# EAGLE design warps_v30 (EAGLE 9.6.2)

## Sheet 1 of 3
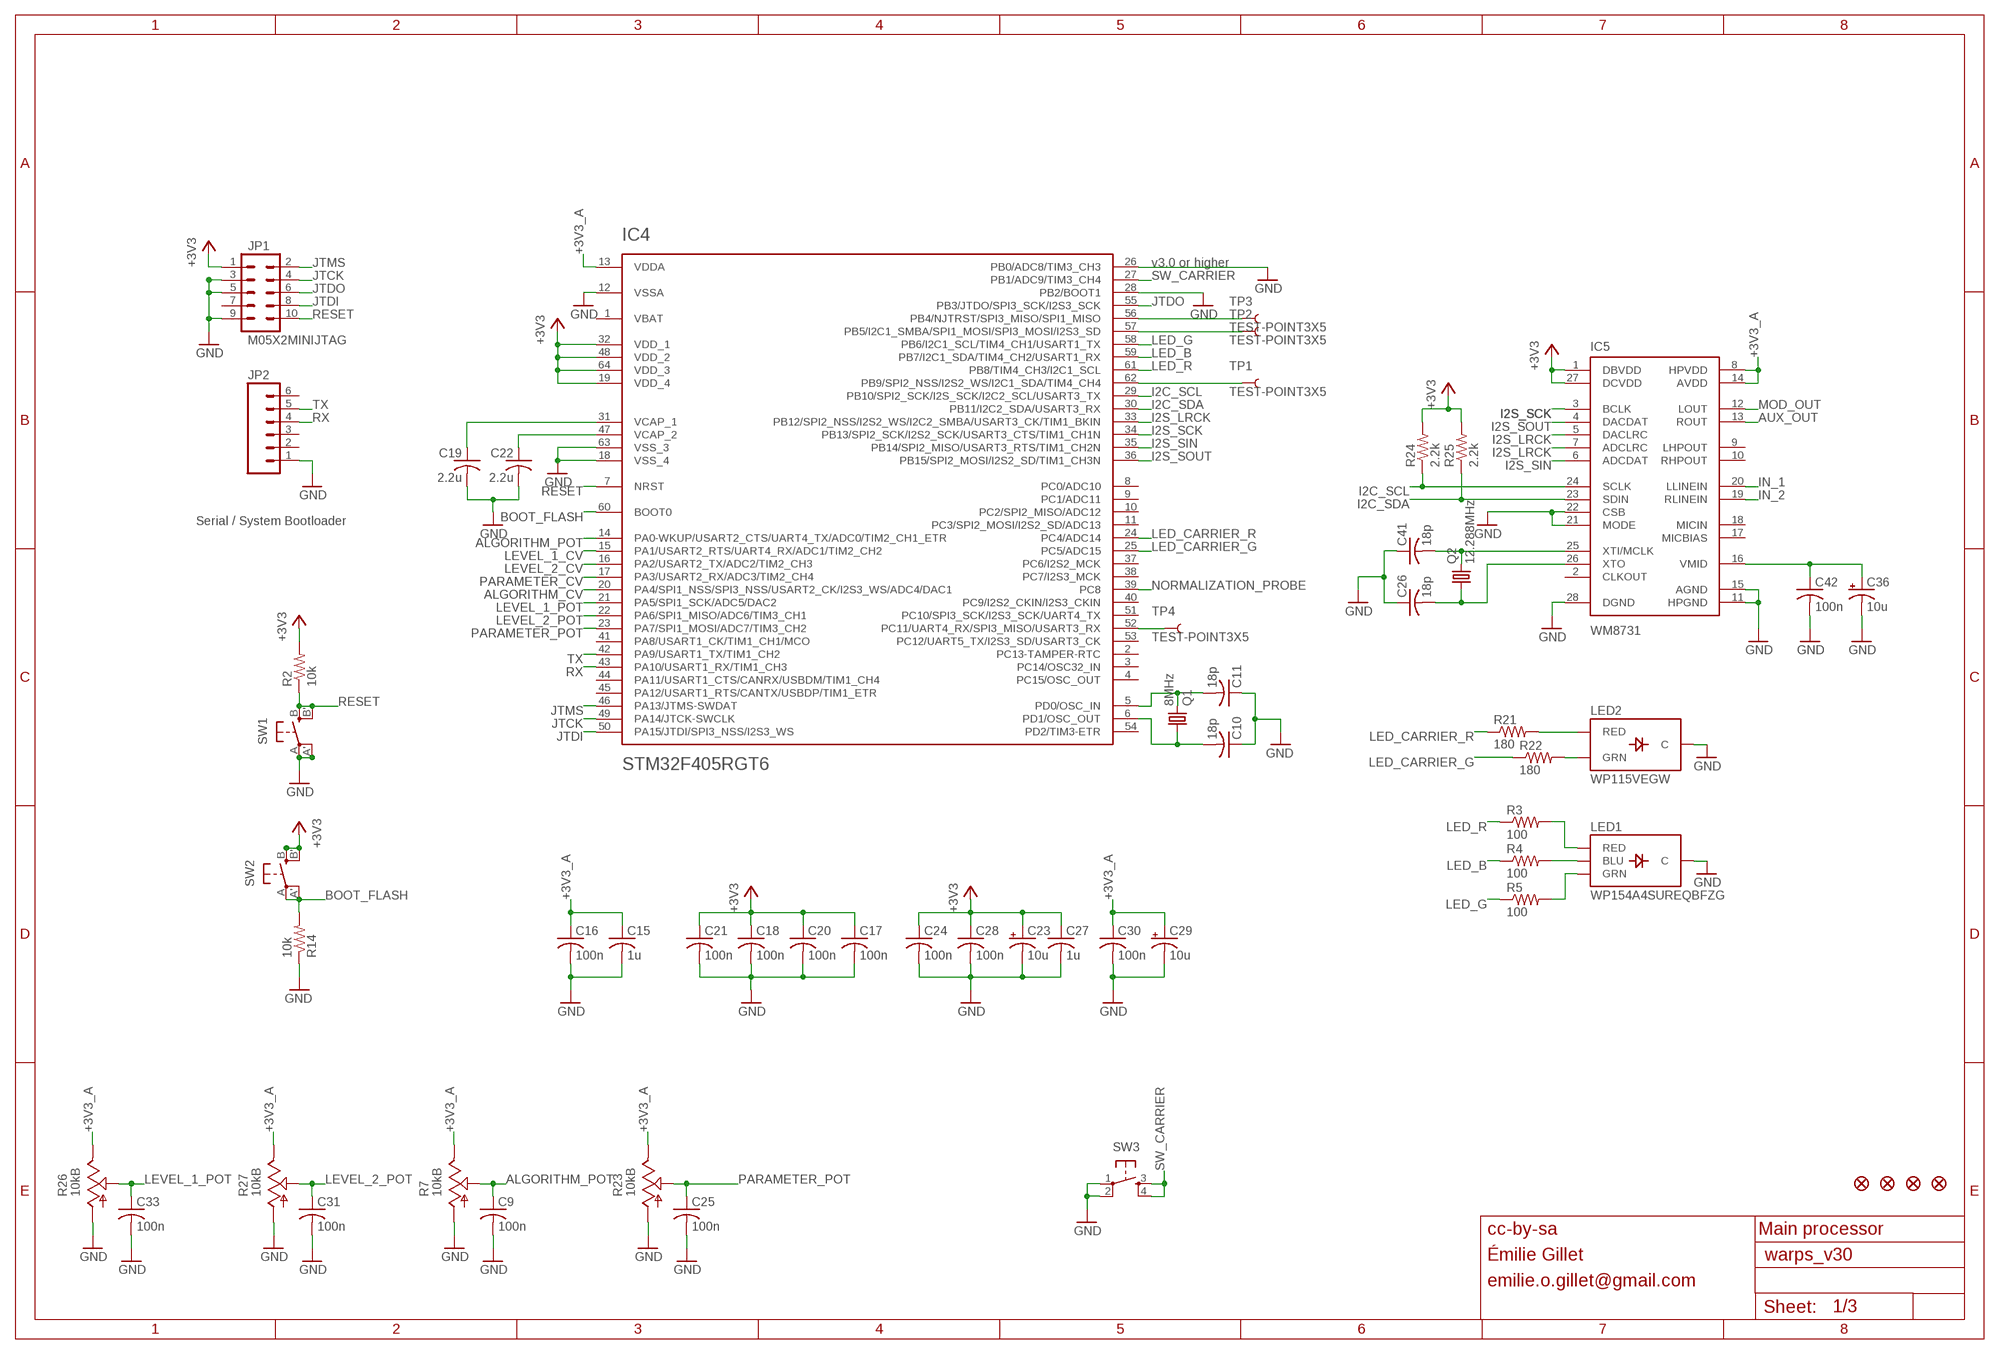
[diagram p0: schematic, sheet 1]

### Parts
C9  100n  C-USC0603  [C0603]
C10  18p  C-USC0603  [C0603]
C11  18p  C-USC0603  [C0603]
C15  1u  C-USC0603  [C0603]
C16  100n  C-USC0603  [C0603]
C17  100n  C-USC0603  [C0603]
C18  100n  C-USC0603  [C0603]
C19  2.2u  C-USC0805  [C0805]
C20  100n  C-USC0603  [C0603]
C21  100n  C-USC0603  [C0603]
C22  2.2u  C-USC0805  [C0805]
C23  10u  CPOL-USA  [PANASONIC_A]
C24  100n  C-USC0603  [C0603]
C25  100n  C-USC0603  [C0603]
C26  18p  C-USC0603  [C0603]
C27  1u  C-USC0603  [C0603]
C28  100n  C-USC0603  [C0603]
C29  10u  CPOL-USA  [PANASONIC_A]
C30  100n  C-USC0603  [C0603]
C31  100n  C-USC0603  [C0603]
C33  100n  C-USC0603  [C0603]
C36  10u  CPOL-USA  [PANASONIC_A]
C41  18p  C-USC0603  [C0603]
C42  100n  C-USC0603  [C0603]
F1  FIDUCIAL1X2  [FIDUCIAL-1X2]
F2  FIDUCIAL1X2  [FIDUCIAL-1X2]
F3  FIDUCIAL1X2  [FIDUCIAL-1X2]
F4  FIDUCIAL1X2  [FIDUCIAL-1X2]
IC4  STM32F405RGT6  STM32F20X  [TQFP-10X10-64]
IC5  WM8731  [SSOP28]
JP1  M05X2MINIJTAG  [2X5-1.27]
JP2  M06SIP  [1X06]
LED1  WP154A4SUREQBFZG  LED-TRICOLOR-THROUGHHOLE  [LED-TRICOLOR-THROUGHHOLE]
LED2  WP115VEGW  LED-BICOLOR-THROUGHHOLE  [LED-BICOLOR-THROUGHHOLE]
Q1  8MHz  CRYSTALHC49UP  [HC49UP]
Q2  12.288MHz  CRYSTALHC49UP  [HC49UP]
R2  10k  R-US_R0603  [R0603]
R3  100  R-US_R0603  [R0603]
R4  100  R-US_R0603  [R0603]
R5  100  R-US_R0603  [R0603]
R7  10kB  POT_USVERTICAL_PS  [ALPS_POT_VERTICAL_PS]
R14  10k  R-US_R0603  [R0603]
R21  180  R-US_R0603  [R0603]
R22  180  R-US_R0603  [R0603]
R23  10kB  POT_USVERTICAL_PS  [ALPS_POT_VERTICAL_PS]
R24  2.2k  R-US_R0603  [R0603]
R25  2.2k  R-US_R0603  [R0603]
R26  10kB  POT_USVERTICAL  [ALPS_POT_VERTICAL]
R27  10kB  POT_USVERTICAL  [ALPS_POT_VERTICAL]
SW1  EVQQ2  [EVQ-Q2]
SW2  EVQQ2  [EVQ-Q2]
SW3  TAC_SWITCHPTH  [TACTILE-PTH]
TP1  TEST-POINT3X5  [PAD.03X.05]
TP2  TEST-POINT3X5  [PAD.03X.05]
TP3  TEST-POINT3X5  [PAD.03X.05]
TP4  TEST-POINT3X5  [PAD.03X.05]

### Nets
+3V3: C17.1 C18.1 C20.1 C21.1 C23.+ C24.1 C27.1 C28.1 IC4.19(VDD_4) IC4.32(VDD_1) IC4.48(VDD_2) IC4.64(VDD_3) IC5.1(DBVDD) IC5.27(DCVDD) JP1.1 R2.2 R24.2 R25.2 SW2.B'(S1) SW2.B(S) ; also sheet 2,3
+3V3_A: C15.1 C16.1 C29.+ C30.1 IC4.13(VDDA) IC5.8(HPVDD) IC5.14(AVDD) R7.P$1(E) R23.P$1(E) R26.P$1(E) R27.P$1(E) ; also sheet 2,3
ALGORITHM_CV: IC4.20(PA4/SPI1_NSS/SPI3_NSS/USART2_CK/I2S3_WS/ADC4/DAC1) ; also sheet 2
ALGORITHM_POT: C9.1 IC4.14(PA0-WKUP/USART2_CTS/UART4_TX/ADC0/TIM2_CH1_ETR) R7.P$2(S)
AUX_OUT: IC5.13(ROUT) ; also sheet 2
BOOT_FLASH: IC4.60(BOOT0) R14.2 SW2.A'(P1) SW2.A(P)
GND: C9.2 C10.1 C11.1 C15.2 C16.2 C17.2 C18.2 C19.2 C20.2 C21.2 C22.2 C23.- C24.2 C25.2 C26.1 C27.2 C28.2 C29.- C30.2 C31.2 C33.2 C36.- C41.1 C42.2 IC4.12(VSSA) IC4.18(VSS_4) IC4.26(PB0/ADC8/TIM3_CH3) IC4.28(PB2/BOOT1) IC4.63(VSS_3) IC5.11(HPGND) IC5.15(AGND) IC5.21(MODE) IC5.22(CSB) IC5.28(DGND) JP1.3 JP1.5 JP1.9 JP2.1 LED1.GND(C) LED2.2(C) R7.P$3(A) R14.1 R23.P$3(A) R26.P$3(A) R27.P$3(A) SW1.A'(P1) SW1.A(P) SW3.1 SW3.2 ; also sheet 2,3
I2C_SCL: IC4.29(PB10/SPI2_SCK/I2S_SCK/I2C2_SCL/USART3_TX) IC5.24(SCLK) R24.1
I2C_SDA: IC4.30(PB11/I2C2_SDA/USART3_RX) IC5.23(SDIN) R25.1
I2S_LRCK: IC4.33(PB12/SPI2_NSS/I2S2_WS/I2C2_SMBA/USART3_CK/TIM1_BKIN) IC5.5(DACLRC) IC5.7(ADCLRC)
I2S_SCK: IC4.34(PB13/SPI2_SCK/I2S2_SCK/USART3_CTS/TIM1_CH1N) IC5.3(BCLK)
I2S_SIN: IC4.35(PB14/SPI2_MISO/USART3_RTS/TIM1_CH2N) IC5.6(ADCDAT)
I2S_SOUT: IC4.36(PB15/SPI2_MOSI/I2S2_SD/TIM1_CH3N) IC5.4(DACDAT)
IN_1: IC5.20(LLINEIN) ; also sheet 2
IN_2: IC5.19(RLINEIN) ; also sheet 2
JTCK: IC4.49(PA14/JTCK-SWCLK) JP1.4
JTDI: IC4.50(PA15/JTDI/SPI3_NSS/I2S3_WS) JP1.8
JTDO: IC4.55(PB3/JTDO/SPI3_SCK/I2S3_SCK) JP1.6
JTMS: IC4.46(PA13/JTMS-SWDAT) JP1.2
LED_B: IC4.59(PB7/I2C1_SDA/TIM4_CH2/USART1_RX) R4.1
LED_CARRIER_G: IC4.25(PC5/ADC15) R22.1
LED_CARRIER_R: IC4.24(PC4/ADC14) R21.1
LED_G: IC4.58(PB6/I2C1_SCL/TIM4_CH1/USART1_TX) R5.1
LED_R: IC4.61(PB8/TIM4_CH3/I2C1_SCL) R3.1
LEVEL_1_CV: IC4.15(PA1/USART2_RTS/UART4_RX/ADC1/TIM2_CH2) ; also sheet 2
LEVEL_1_POT: C33.1 IC4.21(PA5/SPI1_SCK/ADC5/DAC2) R26.P$2(S)
LEVEL_2_CV: IC4.16(PA2/USART2_TX/ADC2/TIM2_CH3) ; also sheet 2
LEVEL_2_POT: C31.1 IC4.22(PA6/SPI1_MISO/ADC6/TIM3_CH1) R27.P$2(S)
MOD_OUT: IC5.12(LOUT) ; also sheet 2
N$3: LED2.3(RED) R21.2
N$7: C11.2 IC4.5(PD0/OSC_IN) Q1.2
N$8: C10.2 IC4.6(PD1/OSC_OUT) Q1.1
N$13: C22.1 IC4.47(VCAP_2)
N$14: LED2.1(GRN) R22.2
N$17: C36.+ C42.1 IC5.16(VMID)
N$19: C19.1 IC4.31(VCAP_1)
N$24: IC4.56(PB4/NJTRST/SPI3_MISO/SPI1_MISO) TP3.P$1
N$26: IC4.57(PB5/I2C1_SMBA/SPI1_MOSI/SPI3_MOSI/I2S3_SD) TP2.P$1
N$27: IC4.52(PC11/UART4_RX/SPI3_MISO/USART3_RX) TP4.P$1
N$30: IC4.62(PB9/SPI2_NSS/I2S2_WS/I2C1_SDA/TIM4_CH4) TP1.P$1
N$35: LED1.RED R3.2
N$36: LED1.BLU R4.2
N$37: LED1.GRN R5.2
N$40: C41.2 IC5.25(XTI/MCLK) Q2.2
N$41: C26.2 IC5.26(XTO) Q2.1
NORMALIZATION_PROBE: IC4.39(PC8) ; also sheet 2
PARAMETER_CV: IC4.17(PA3/USART2_RX/ADC3/TIM2_CH4) ; also sheet 2
PARAMETER_POT: C25.1 IC4.23(PA7/SPI1_MOSI/ADC7/TIM3_CH2) R23.P$2(S)
RESET: IC4.7(NRST) JP1.10 R2.1 SW1.B'(S1) SW1.B(S)
RX: IC4.43(PA10/USART1_RX/TIM1_CH3) JP2.4
SW_CARRIER: IC4.27(PB1/ADC9/TIM3_CH4) SW3.3 SW3.4
TX: IC4.42(PA9/USART1_TX/TIM1_CH2) JP2.5
Unconnected: IC4.2(PC13-TAMPER-RTC) IC4.3(PC14/OSC32_IN) IC4.4(PC15/OSC_OUT) IC4.8(PC0/ADC10) IC4.9(PC1/ADC11) IC4.10(PC2/SPI2_MISO/ADC12) IC4.11(PC3/SPI2_MOSI/I2S2_SD/ADC13) IC4.37(PC6/I2S2_MCK) IC4.38(PC7/I2S3_MCK) IC4.40(PC9/I2S2_CKIN/I2S3_CKIN) IC4.41(PA8/USART1_CK/TIM1_CH1/MCO) IC4.44(PA11/USART1_CTS/CANRX/USBDM/TIM1_CH4) IC4.45(PA12/USART1_RTS/CANTX/USBDP/TIM1_ETR) IC4.51(PC10/SPI3_SCK/I2S3_SCK/UART4_TX) IC4.53(PC12/UART5_TX/I2S3_SD/USART3_CK) IC4.54(PD2/TIM3-ETR) IC5.2(CLKOUT) IC5.9(LHPOUT) IC5.10(RHPOUT) IC5.17(MICBIAS) IC5.18(MICIN) JP1.7 JP2.2 JP2.3 JP2.6

### Notes on the sheet
- v3.0 or higher
- Serial / System Bootloader
- cc-by-sa | Main processor
- Émilie Gillet
- emilie.o.gillet@gmail.com

## Sheet 2 of 3
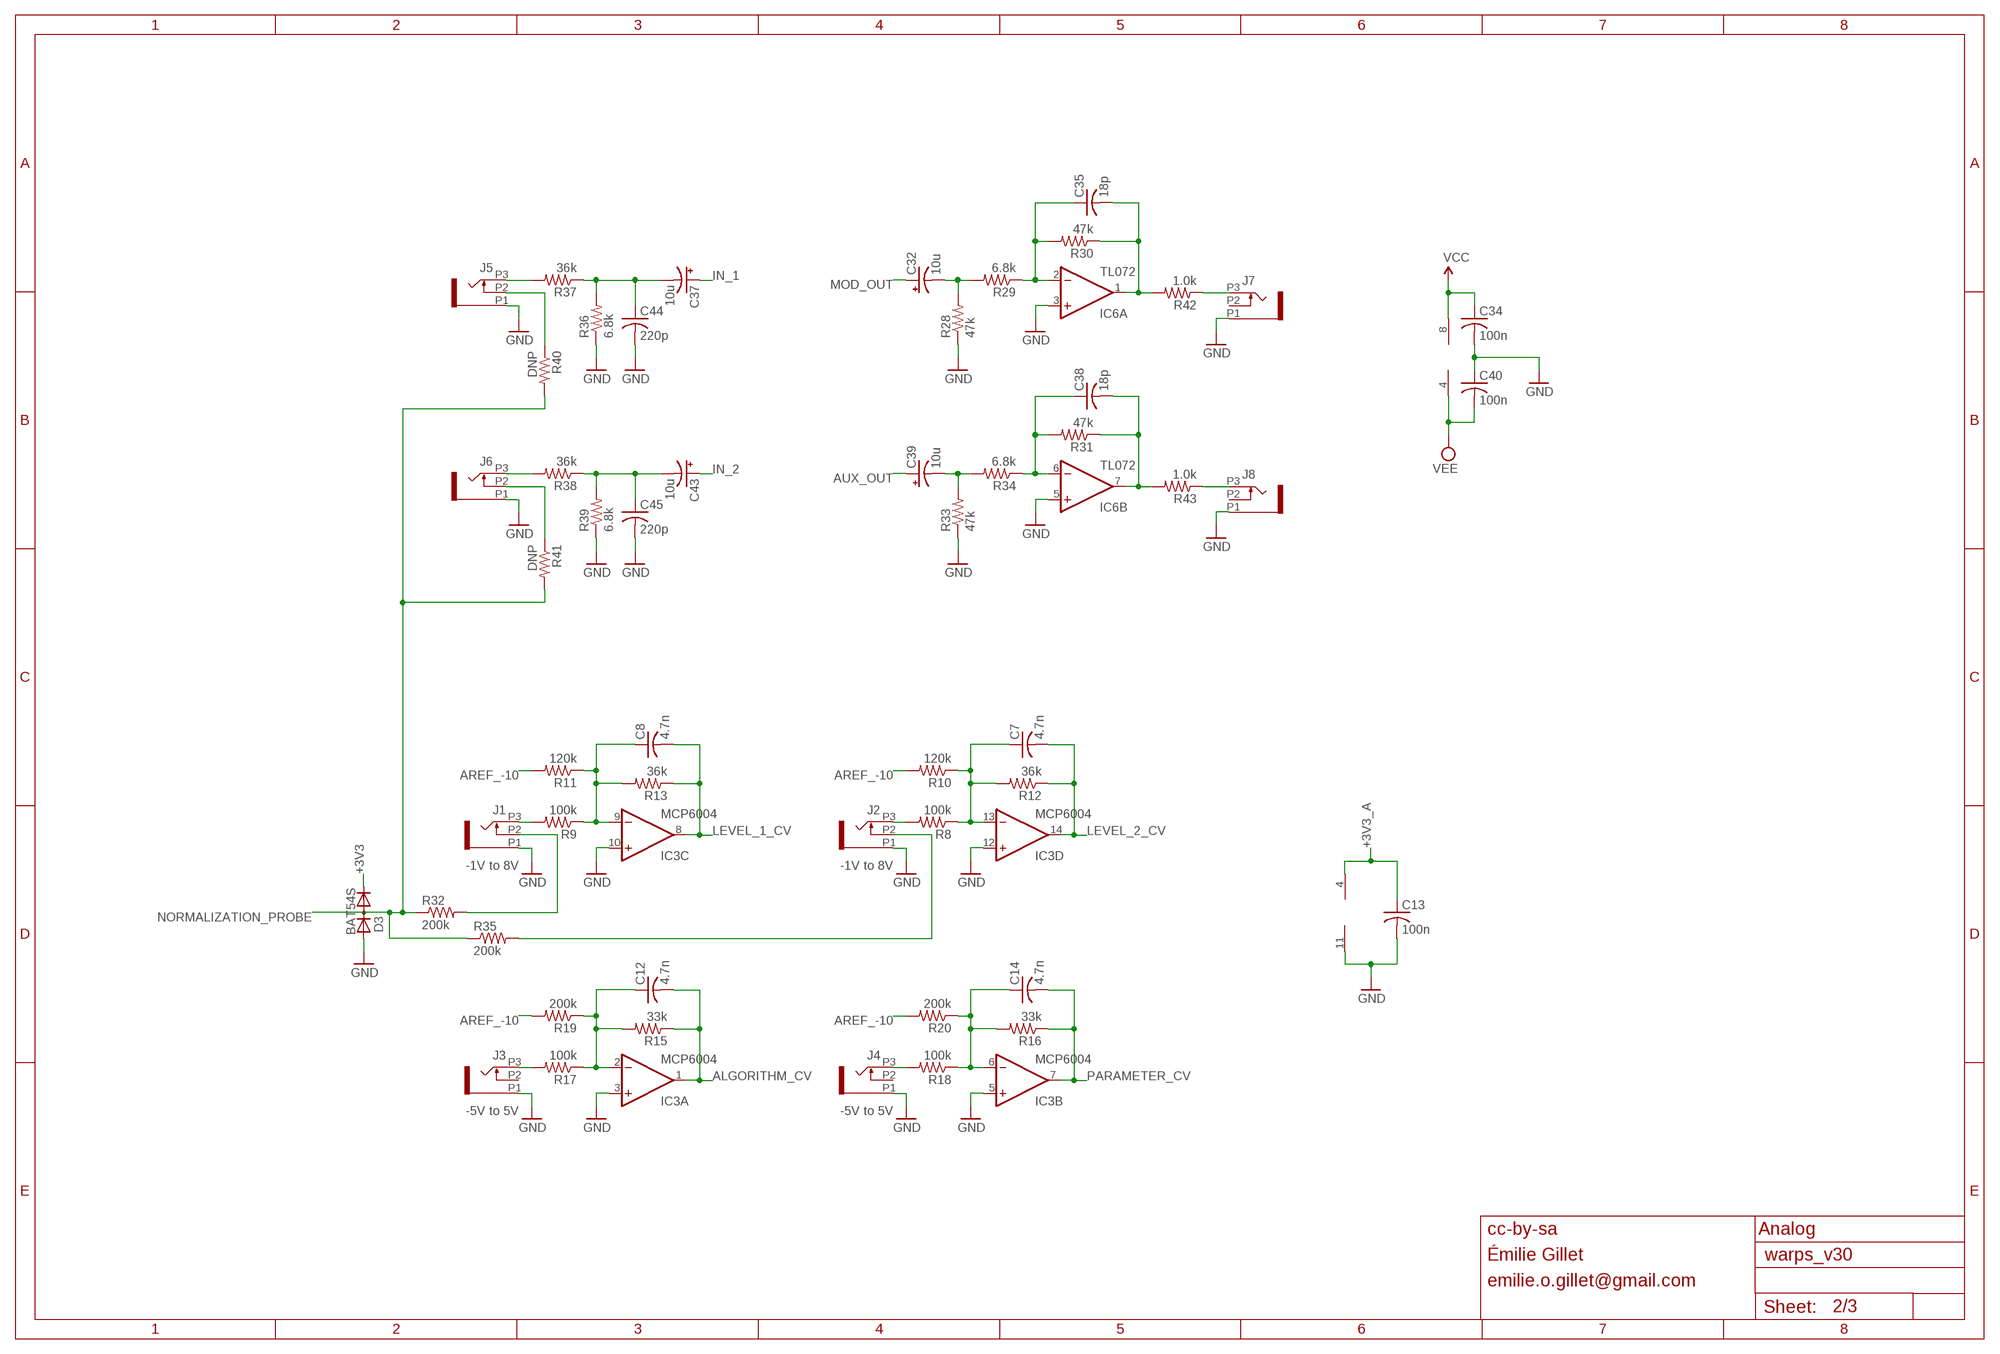
[diagram p1: schematic, sheet 2]

### Parts
C7  4.7n  C-USC0603  [C0603]
C8  4.7n  C-USC0603  [C0603]
C12  4.7n  C-USC0603  [C0603]
C13  100n  C-USC0603  [C0603]
C14  4.7n  C-USC0603  [C0603]
C32  10u  CPOL-USA  [PANASONIC_A]
C34  100n  C-USC0603  [C0603]
C35  18p  C-USC0603  [C0603]
C37  10u  CPOL-USA  [PANASONIC_A]
C38  18p  C-USC0603  [C0603]
C39  10u  CPOL-USA  [PANASONIC_A]
C40  100n  C-USC0603  [C0603]
C43  10u  CPOL-USA  [PANASONIC_A]
C44  220p  C-USC0603  [C0603]
C45  220p  C-USC0603  [C0603]
D3  BAT54S  DIODE_2CACA-SOT23  [SOT23]
IC3  MCP6004  TL074D  [SO14]
IC6  TL072  TL072D  [SO08]
J1  PJ301_THONKICONN6  [WQP_PJ_301M6]
J2  PJ301_THONKICONN6  [WQP_PJ_301M6]
J3  PJ301_THONKICONN6  [WQP_PJ_301M6]
J4  PJ301_THONKICONN6  [WQP_PJ_301M6]
J5  PJ301_THONKICONN6  [WQP_PJ_301M6]
J6  PJ301_THONKICONN6  [WQP_PJ_301M6]
J7  PJ301_THONKICONN6  [WQP_PJ_301M6]
J8  PJ301_THONKICONN6  [WQP_PJ_301M6]
R8  100k  R-US_R0603  [R0603]
R9  100k  R-US_R0603  [R0603]
R10  120k  R-US_R0603  [R0603]
R11  120k  R-US_R0603  [R0603]
R12  36k  R-US_R0603  [R0603]
R13  36k  R-US_R0603  [R0603]
R15  33k  R-US_R0603  [R0603]
R16  33k  R-US_R0603  [R0603]
R17  100k  R-US_R0603  [R0603]
R18  100k  R-US_R0603  [R0603]
R19  200k  R-US_R0603  [R0603]
R20  200k  R-US_R0603  [R0603]
R28  47k  R-US_R0603  [R0603]
R29  6.8k  R-US_R0603  [R0603]
R30  47k  R-US_R0603  [R0603]
R31  47k  R-US_R0603  [R0603]
R32  200k  R-US_R0603  [R0603]
R33  47k  R-US_R0603  [R0603]
R34  6.8k  R-US_R0603  [R0603]
R35  200k  R-US_R0603  [R0603]
R36  6.8k  R-US_R0603  [R0603]
R37  36k  R-US_R0603  [R0603]
R38  36k  R-US_R0603  [R0603]
R39  6.8k  R-US_R0603  [R0603]
R40  DNP  R-US_R0603  [R0603]
R41  DNP  R-US_R0603  [R0603]
R42  1.0k  R-US_R0603  [R0603]
R43  1.0k  R-US_R0603  [R0603]

### Nets
+3V3: D3.2(C) ; also sheet 1,3
+3V3_A: C13.1 IC3.4(P:V+) ; also sheet 1,3
ALGORITHM_CV: C12.2 IC3.1(A:OUT) R15.1 ; also sheet 1
AREF_-10: R10.2 R11.2 R19.2 R20.2 ; also sheet 3
AUX_OUT: C39.+ ; also sheet 1
GND: C13.2 C34.2 C40.1 C44.2 C45.2 D3.1(A) IC3.3(A:+IN) IC3.5(B:+IN) IC3.10(C:+IN) IC3.11(P:V-) IC3.12(D:+IN) IC6.3(A:+IN) IC6.5(B:+IN) J1.P1 J2.P1 J3.P1 J4.P1 J5.P1 J6.P1 J7.P1 J8.P1 R28.1 R33.1 R36.1 R39.1 ; also sheet 1,3
IN_1: C37.+ ; also sheet 1
IN_2: C43.+ ; also sheet 1
LEVEL_1_CV: C8.2 IC3.8(C:OUT) R13.1 ; also sheet 1
LEVEL_2_CV: C7.2 IC3.14(D:OUT) R12.1 ; also sheet 1
MOD_OUT: C32.+ ; also sheet 1
N$1: J1.P3 R9.2
N$2: C8.1 IC3.9(C:-IN) R9.1 R11.1 R13.2
N$4: J2.P3 R8.2
N$5: C7.1 IC3.13(D:-IN) R8.1 R10.1 R12.2
N$6: J4.P3 R18.2
N$9: J1.P2 R32.2
N$10: J3.P3 R17.2
N$11: C12.1 IC3.2(A:-IN) R15.2 R17.1 R19.1
N$12: J2.P2 R35.2
N$15: C14.1 IC3.6(B:-IN) R16.2 R18.1 R20.1
N$18: C37.- C44.1 R36.2 R37.1
N$20: J6.P3 R38.2
N$21: J5.P3 R37.2
N$22: C43.- C45.1 R38.1 R39.2
N$23: C39.- R33.2 R34.2
N$25: C38.1 IC6.6(B:-IN) R31.2 R34.1
N$28: C38.2 IC6.7(B:OUT) R31.1 R43.2
N$29: J8.P3 R43.1
N$31: C32.- R28.2 R29.2
N$32: C35.1 IC6.2(A:-IN) R29.1 R30.2
N$33: C35.2 IC6.1(A:OUT) R30.1 R42.2
N$34: J7.P3 R42.1
N$38: J6.P2 R41.1
N$39: J5.P2 R40.1
NORMALIZATION_PROBE: D3.3(AC) R32.1 R35.1 R40.2 R41.2 ; also sheet 1
PARAMETER_CV: C14.2 IC3.7(B:OUT) R16.1 ; also sheet 1
VCC: C34.1 IC6.8(P:V+) ; also sheet 3
VEE: C40.2 IC6.4(P:V-) ; also sheet 3
Unconnected: J3.P2 J4.P2 J7.P2 J8.P2

### Notes on the sheet
- -1V to 8V | -1V to 8V
- -5V to 5V | -5V to 5V
- cc-by-sa | Analog
- Émilie Gillet
- emilie.o.gillet@gmail.com

## Sheet 3 of 3
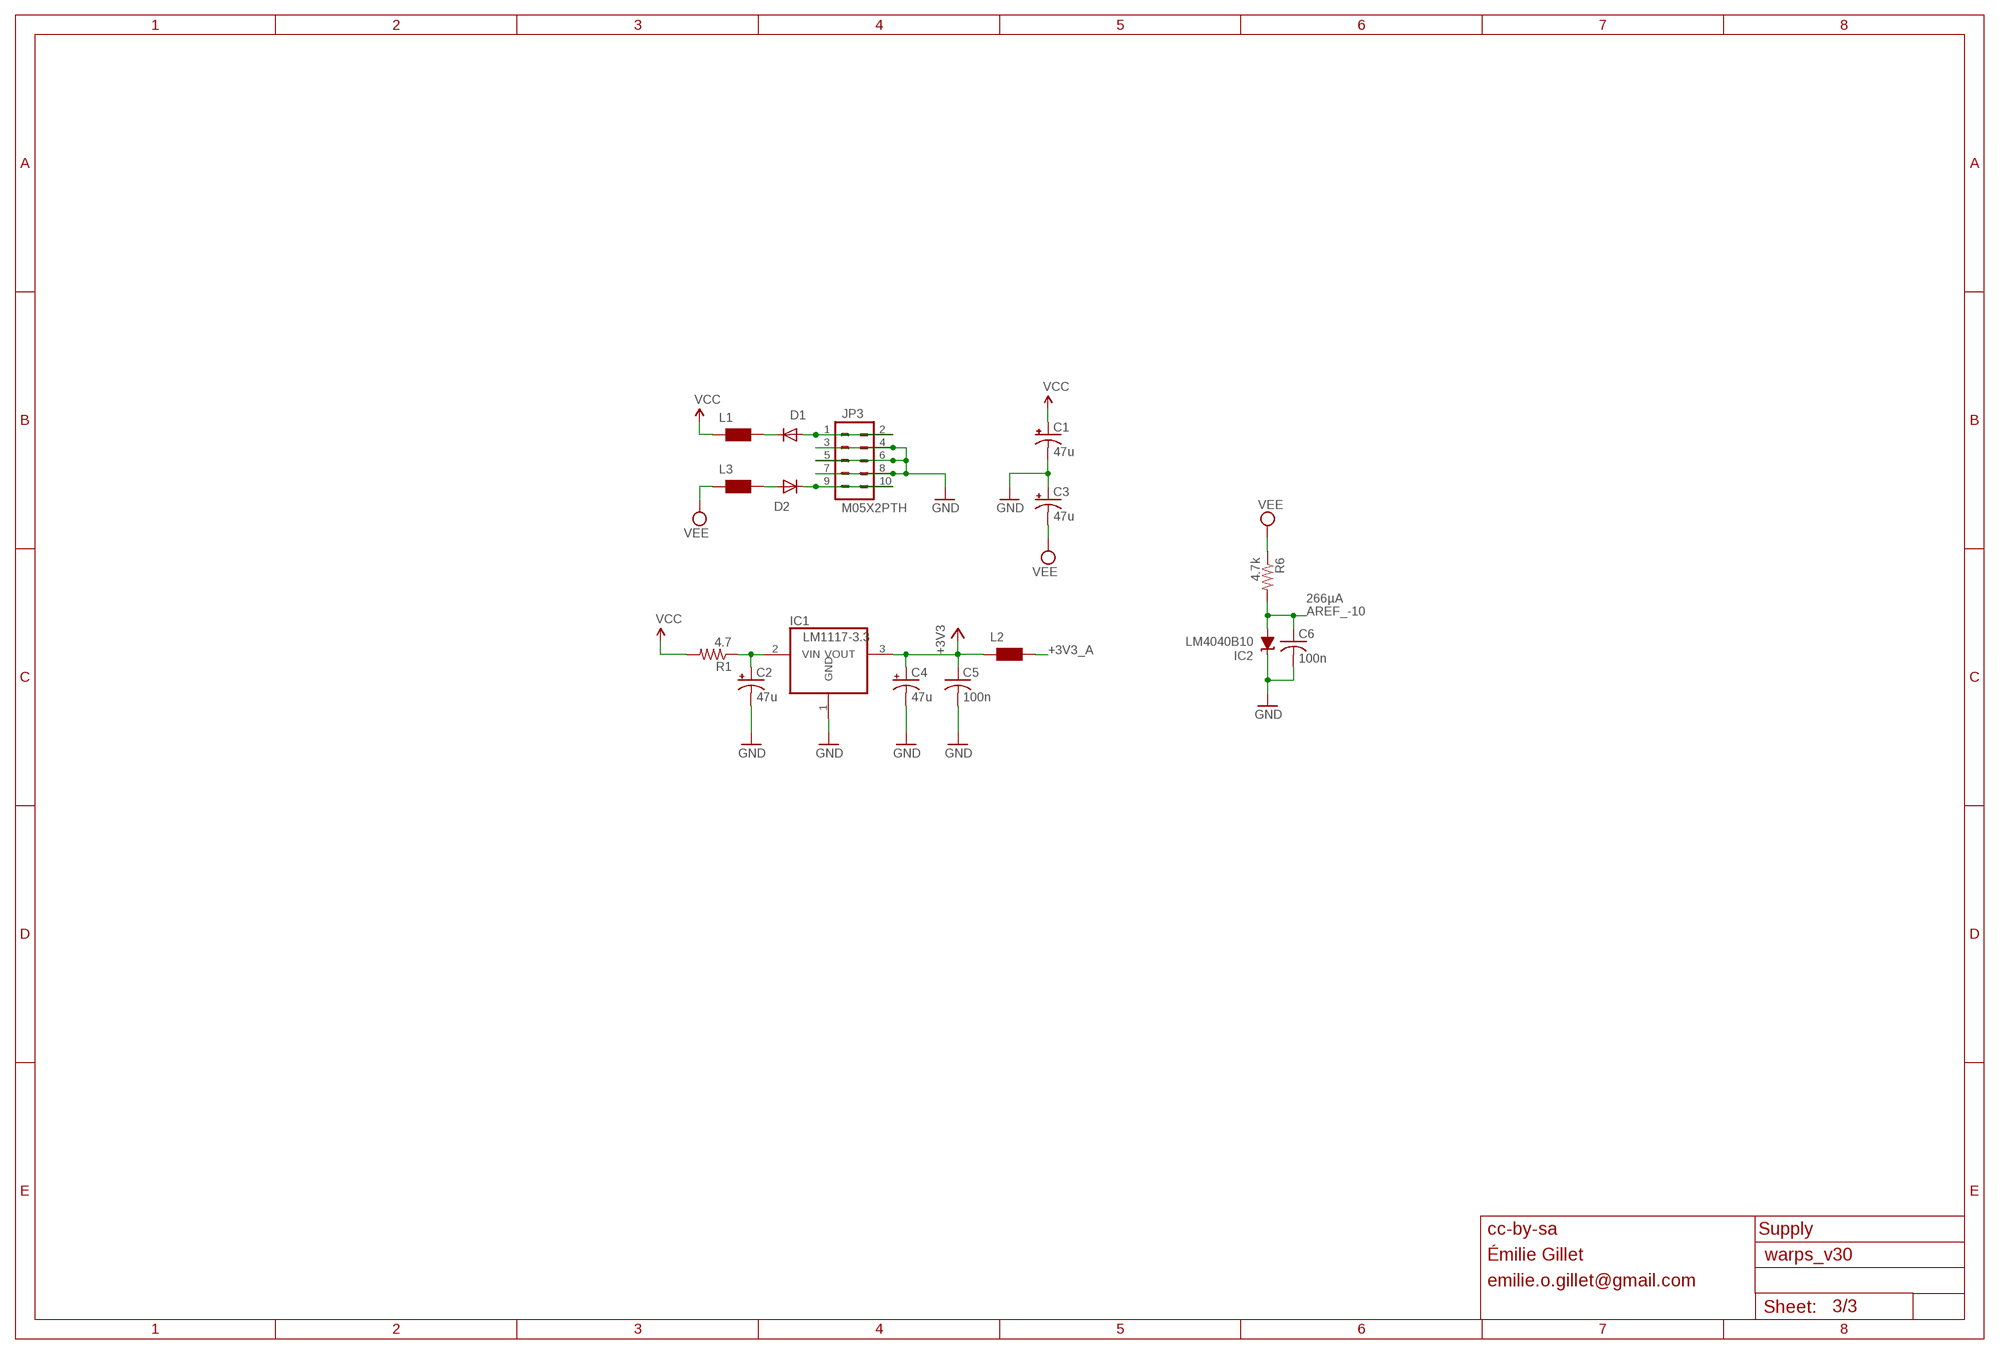
[diagram p2: schematic, sheet 3]

### Parts
C1  47u  CPOL-USD  [PANASONIC_D]
C2  47u  CPOL-USD  [PANASONIC_D]
C3  47u  CPOL-USD  [PANASONIC_D]
C4  47u  CPOL-USD  [PANASONIC_D]
C5  100n  C-USC0603  [C0603]
C6  100n  C-USC0603  [C0603]
D1  1N5819HW  DIODE-SOD123  [SOD123]
D2  1N5819HW  DIODE-SOD123  [SOD123]
IC1  LM1117-3.3  REG1117T  [TO252]
IC2  LM4040B10  LM4041B12DBZ  [DBZ_R-PDSO-G3]
JP3  M05X2PTH  [AVR_ICSP]
L1  WE-CBF_0603  [0603]
L2  WE-CBF_0603  [0603]
L3  WE-CBF_0603  [0603]
R1  4.7  R-US_R1206  [R1206]
R6  4.7k  R-US_R0603  [R0603]

### Nets
+3V3: C4.+ C5.1 IC1.3(VOUT) L2.1 ; also sheet 1,2
+3V3_A: L2.2 ; also sheet 1,2
AREF_-10: C6.1 IC2.2(A) R6.2 ; also sheet 2
GND: C1.- C2.- C3.+ C4.- C5.2 C6.2 IC1.1(GND) IC2.1(C) JP3.3 JP3.4 JP3.5 JP3.6 JP3.7 JP3.8 ; also sheet 1,2
N$16: C2.+ IC1.2(VIN) R1.1
N$42: D1.C L1.2
N$43: D2.A L3.2
N$56: D1.A JP3.1 JP3.2
N$64: D2.C JP3.9 JP3.10
VCC: C1.+ L1.1 R1.2 ; also sheet 2
VEE: C3.- L3.1 R6.1 ; also sheet 2

### Notes on the sheet
- 266µA
- cc-by-sa | Supply
- Émilie Gillet
- emilie.o.gillet@gmail.com

## Power pins joined to a net without a drawn wire
VBAT: IC4.1(VBAT)

## Library data of the parts
C1-C4 C23 C29 C32 C36 C37 C39 C43 = rcl:CPOL-US: POLARIZED CAPACITOR, American symbol
C5-C22 C24-C28 C30 C31 C33-C35 C38 C40-C42 C44 C45 = rcl:C-US: CAPACITOR, American symbol
D1 D2 = diode:DIODE-: DIODE
D3 = diode:DIODE_2CACA-: 2 Diodes - Cathode-Anode|Cathode-Anode
F1-F4 = SparkFun:FIDUCIAL: Fiducial Alignment Points Various fiducial points for machine vision alignment.
IC1 = og-vreg:REG1117: 800mA and 1A Low Dropout (LDO) Positive Regulator 1.8V, 2.5V, 2.85V, 3.3V, 5V, and Adj
IC2 = texas:LM4041: PRECISION MICROPOWER SHUNT VOLTAGE REFERENCE Source: http://focus.ti.com/lit/ds/slcs146e/slcs146e.pdf
IC3 = gm-ics:TL074: OP AMP
IC4 = og-stm32f2:STM32F20X
IC5 = og-dac:WM8731
IC6 = og-linear:TL072: OP AMP
J1-J8 = og-pj301:PJ301_THONKICONN
JP1 JP3 = og-header:M05X2: Header 5x2 Standard 10-pin dual row 0.1" header. Commonly used with AVR-ISP. Use with Spark Fun Electronics SKU: PRT-00778
JP2 = SparkFun:M06: Header 6 Standard 6-pin 0.1" header. Use with straight break away headers (SKU : PRT-00116), right angle break away headers (PRT-00553), swiss pins (PRT-00743), machine pins (PRT-00117), and female headers (PRT-00115). Molex polarized connector foot print use with SKU : PRT-08094 with associated crimp pins and housings. NOTES ON THE VARIANTS LOCK and LOCK_LONGPADS... This footprint was designed to help hold the alignment of a through-hole component (i.e. 6-pin header) while soldering it into place. You may notice that each hole has been shifted either up or down by 0.005 of an inch from it's more standard position (which is a perfectly straight line). This slight alteration caused the pins (the squares in the middle) to touch the edges of the holes. Because they are alternating, it causes a "brace" to hold the component in place. 0.005 has proven to be the perfect amount of "off-center" position when using our standard breakaway headers. Although looks a little odd when you look at the bare footprint, once you have a header in there, the alteration is very hard to notice. Also, if you push a header all the way into place, it is covered up entirely on the bottom side. This idea of altering the position of holes to aid alignment will be further integrated into the Sparkfun Library for other footprints. It can help hold any component with 3 or more connection pins.
L1-L3 = wuerth-elektronik:WE-CBF: SMD EMI Suppression Ferrite Beads - excellent anti-EMI properties - low DCR - impedances till 3000 ohms - rated current up to 6 A
LED1 = og-leds:LED-TRICOLOR-THROUGHHOLE
LED2 = og-leds:LED-BICOLOR-THROUGHHOLE
Q1 Q2 = crystal:CRYSTAL: CRYSTAL
R1-R6 R8-R22 R24 R25 R28-R43 = rcl:R-US_: RESISTOR, American symbol
R7 R23 R26 R27 = og-pots:POT_US
SW1 SW2 = adafruit:EVQQ2: SMT 6mm switch, EVQQ2 series http://www.ladyada.net/library/eagle
SW3 = SparkFun:TAC_SWITCH: Momentary Switch Button commonly used for reset or general input. Spark Fun Electronics SKU : COM-00097
TP1-TP4 = SparkFun:TEST-POINT

## Board
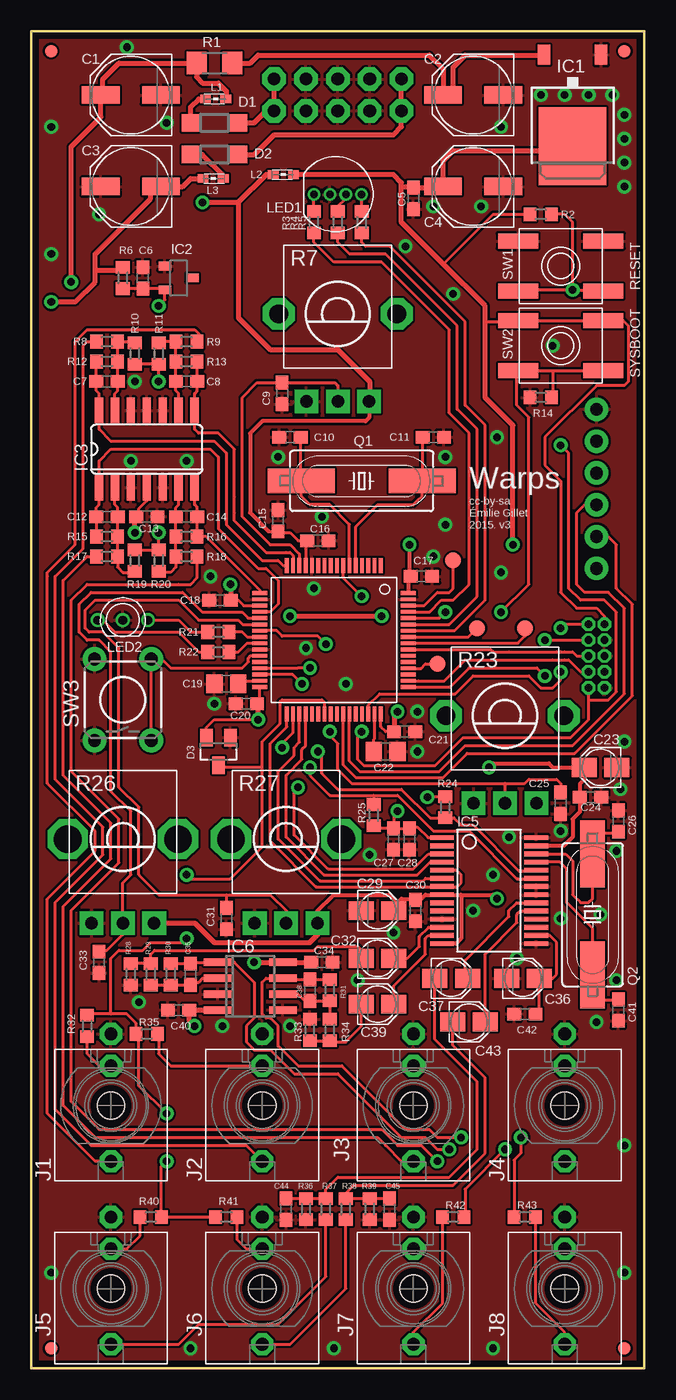
[diagram p3: board, top side]
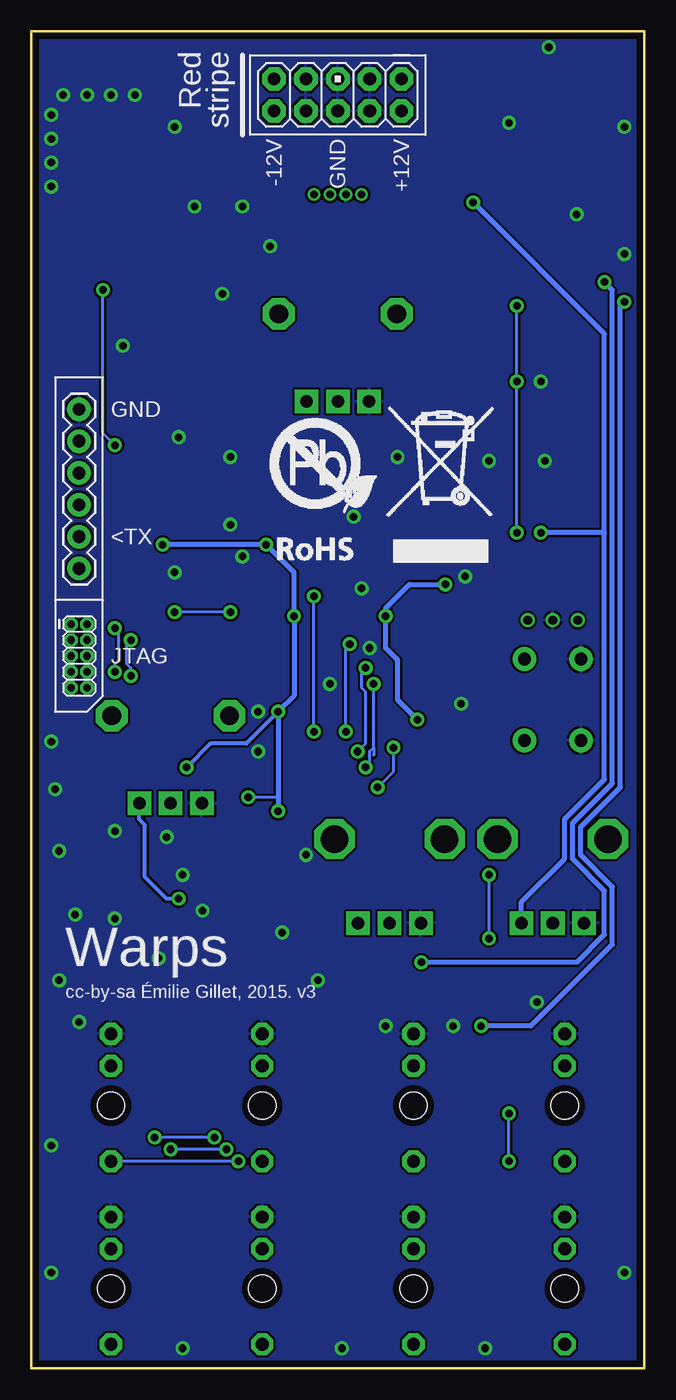
[diagram p4: board, bottom side, seen from below]

Size 48.9 x 106.68 mm. Coordinates in mm from the lower left corner, seen from the top.
Outline: 0,0 48.9,0 48.9,106.68 0,106.68 0,0
Copper layers (1*16): Top 0.035mm / dielectric 1.5mm / Bottom 0.035mm
Design rules "PCBCart-Standard-Fine": minimum track width 8mil, minimum drill 0.4mm, track to track 7mil, track to pad 7mil, pad to pad 7mil, via to via 7mil, smd to smd 7mil, copper to edge 20mil, drill to drill 8mil, minimum pad ring 8mil, minimum via ring 10mil, stop-mask expansion 3mil, vias tented up to drill 25mil, thermal gap 8mil

### Footprints (pad centres in the part's own frame; a part is rotated, then mirrored left to right if it is on the bottom)
PANASONIC_D = smd 3 x 1.4: + 2.4,0; - -2.4,0
C0603 = smd 1.1 x 1: 1 -0.85,0; 2 0.85,0
C0805 = smd 1.3 x 1.5: 1 -0.95,0; 2 0.95,0
PANASONIC_A = smd 2 x 1.5: + 1.3,0; - -1.3,0
SOD123 = smd 1.4 x 1.4: A 1.9,0; C -1.9,0
SOT23 = smd 1 x 1.4: 1 -0.95,-1.1; 2 0.95,-1.1; 3 0,1.1
FIDUCIAL-1X2 = smd 1 x 1: 1 0,0
TO252 = smd 1 x 1.6: 1 -2.28,-4.8; 2 2.28,-4.8 | smd 5.4 x 6.2: 3 0,2.5
DBZ_R-PDSO-G3 = smd 0.7 x 1: 1 -0.95,-1.1; 2 0.95,-1.1; 3 0,1.1
SO14 = smd 0.66 x 2.032: 1 -3.81,-3.073; 2 -2.54,-3.073; 3 -1.27,-3.073; 4 0,-3.073; 5 1.27,-3.073; 6 2.54,-3.073; 7 3.81,-3.073; 8 3.81,3.073; 9 2.54,3.073; 10 1.27,3.073; 11 0,3.073; 12 -1.27,3.073; 13 -2.54,3.073; 14 -3.81,3.073
TQFP-10X10-64 = smd 1.2 x 0.3: 1 -5.936,3.75; 2 -5.936,3.25; 3 -5.936,2.75; 4 -5.936,2.25; 5 -5.936,1.75; 6 -5.936,1.25; 7 -5.936,0.75; 8 -5.936,0.25; 9 -5.936,-0.25; 10 -5.936,-0.75; 11 -5.936,-1.25; 12 -5.936,-1.75; 13 -5.936,-2.25; 14 -5.936,-2.75; 15 -5.936,-3.25; 16 -5.936,-3.75; 33 5.886,-3.75; 34 5.886,-3.25; 35 5.886,-2.75; 36 5.886,-2.25; 37 5.886,-1.75; 38 5.886,-1.25; 39 5.886,-0.75; 40 5.886,-0.25; 41 5.886,0.25; 42 5.886,0.75; 43 5.886,1.25; 44 5.886,1.75; 45 5.886,2.25; 46 5.886,2.75; 47 5.886,3.25; 48 5.886,3.75 | smd 0.3 x 1.2: 17 -3.75,-5.911; 18 -3.25,-5.911; 19 -2.75,-5.911; 20 -2.25,-5.911; 21 -1.75,-5.911; 22 -1.25,-5.911; 23 -0.75,-5.911; 24 -0.25,-5.911; 25 0.25,-5.911; 26 0.75,-5.911; 27 1.25,-5.911; 28 1.75,-5.911; 29 2.25,-5.911; 30 2.75,-5.911; 31 3.25,-5.911; 32 3.75,-5.911; 49 3.75,5.936; 50 3.25,5.936; 51 2.75,5.936; 52 2.25,5.936; 53 1.75,5.936; 54 1.25,5.936; 55 0.75,5.936; 56 0.25,5.936; 57 -0.25,5.936; 58 -0.75,5.936; 59 -1.25,5.936; 60 -1.75,5.936; 61 -2.25,5.936; 62 -2.75,5.936; 63 -3.25,5.936; 64 -3.75,5.936
SSOP28 = smd 0.381 x 1.905: 1 -4.55,-3.752; 2 -3.9,-3.752; 3 -3.25,-3.752; 4 -2.6,-3.752; 5 -1.95,-3.752; 6 -1.3,-3.752; 7 -0.65,-3.752; 8 0,-3.752; 9 0.65,-3.752; 10 1.3,-3.752; 11 1.95,-3.752; 12 2.6,-3.752; 13 3.25,-3.752; 14 3.9,-3.752; 15 3.9,3.752; 16 3.25,3.752; 17 2.6,3.752; 18 1.95,3.752; 19 1.3,3.752; 20 0.65,3.752; 21 0,3.752; 22 -0.65,3.752; 23 -1.3,3.752; 24 -1.95,3.752; 25 -2.6,3.752; 26 -3.25,3.752; 27 -3.9,3.752; 28 -4.55,3.752
SO08 = smd 0.6 x 2.2: 1 -1.905,-2.6; 2 -0.635,-2.6; 3 0.635,-2.6; 4 1.905,-2.6; 5 1.905,2.6; 6 0.635,2.6; 7 -0.635,2.6; 8 -1.905,2.6
WQP_PJ_301M6 = drill 1.016 pad 1.778 octagon: P1 0,-5.715; P2 0,-3.175; P3 0,4.445 | hole 2.2: 0,0
2X5-1.27 = drill 0.61 pad 1.067 octagon: 1 -1.27,3.81; 2 0,3.81; 3 -1.27,2.54; 4 0,2.54; 5 -1.27,1.27; 6 0,1.27; 7 -1.27,0; 8 0,0; 9 -1.27,-1.27; 10 0,-1.27
1X06 = drill 1.016 pad 1.88: 1 0,0; 2 2.54,0; 3 5.08,0; 4 7.62,0; 5 10.16,0; 6 12.7,0
AVR_ICSP = drill 1.016 pad 1.88 octagon: 1 -1.27,5.08; 2 1.27,5.08; 3 -1.27,2.54; 4 1.27,2.54; 5 -1.27,0; 6 1.27,0; 7 -1.27,-2.54; 8 1.27,-2.54; 9 -1.27,-5.08; 10 1.27,-5.08
0603 = smd 0.85 x 0.7: 1 -0.9,0; 2 0.7,0
LED-TRICOLOR-THROUGHHOLE = drill 0.6: BLU 0.635,0; GND -0.635,0; GRN 1.905,0; RED -1.905,0
LED-BICOLOR-THROUGHHOLE = drill 0.7: 1 -2,0; 2 0,0; 3 2,0
HC49UP = smd 5.334 x 1.93: 1 -4.826,0; 2 4.826,0
R1206 = smd 1.6 x 1.803: 1 -1.422,0; 2 1.422,0
R0603 = smd 1 x 1.1: 1 -0.85,0; 2 0.85,0
ALPS_POT_VERTICAL_PS = drill 1 pad 1.88 square: P$1 -2.5,7; P$2 0,7; P$3 2.5,7 | drill 1.5 pad 2.54 octagon: P$4 -4.7,0; P$5 4.7,0
ALPS_POT_VERTICAL = drill 1 pad 1.88 square: P$1 -2.5,6.7; P$2 0,6.7; P$3 2.5,6.7 | drill 2.2 pad 3.175 octagon: P$4 -4.4,0; P$5 4.4,0
EVQ-Q2 = smd 3.2 x 1.2: A -3.4,-2; A' 3.4,-2; B -3.4,2; B' 3.4,2
TACTILE-PTH = drill 1.016 pad 1.88: 1 -3.251,2.261; 2 3.251,2.261; 3 -3.251,-2.261; 4 3.251,-2.261
PAD.03X.05 = smd 1.27 x 1.27: P$1 0,0

### Placement (x,y rotation side)
C1  7.94,101.6 180 top
C2  35.24,101.6 180 top
C3  7.94,94.3 180 top
C4  35.24,94.3 180 top
C5  30.48,93.34 270 top
C6  8.89,87 90 top
C7  6.03,78.74 180 top
C8  12.38,78.74 0 top
C9  20,77.79 270 top
C10  20.64,74.3 0 top
C11  32.07,74.3 180 top
C12  6.03,67.94 180 top
C13  9.21,67.94 0 top
C14  12.38,67.94 0 top
C15  19.68,67.63 90 top
C16  22.86,66.04 0 top
C17  31.11,63.18 0 top
C18  15.05,61.28 180 top
C19  15.56,54.61 180 top
C20  17.14,53.02 180 top
C21  29.78,50.8 0 top
C22  28.26,49.21 0 top
C23  45.4,47.94 180 top
C24  44.61,45.56 0 top
C25  42.23,45.09 270 top
C26  46.83,43.66 270 top
C27  28.89,42.23 270 top
C28  30.16,42.23 270 top
C29  27.62,36.51 0 top
C30  30.64,36.51 270 top
C31  15.56,35.88 270 top
C32  27.62,32.7 0 top
C33  5.4,32.38 270 top
C34  23.18,32.38 0 top
C35  12.7,31.43 90 top
C36  39.21,31.11 0 top
C37  33.5,31.11 0 top
C38  22.23,30.16 90 top
C39  27.62,29.05 0 top
C40  11.75,28.57 0 top
C41  46.83,28.57 90 top
C42  39.37,28.26 180 top
C43  34.92,27.62 0 top
C44  20.32,12.7 270 top
C45  28.57,12.7 270 top
D1  14.61,99.38 0 top
D2  14.61,96.84 180 top
D3  14.92,49.21 180 top
F1  1.59,105.09 0 top
F2  47.31,105.09 0 top
F3  1.59,1.59 0 top
F4  47.31,1.59 0 top
IC1  43.18,100.01 180 top
IC2  11.75,87 270 top
IC3  9.21,73.34 0 top
IC4  24.13,58.1 270 top
IC5  36.51,37.78 270 top
IC6  17.46,30.48 270 top
J1  6.35,20.95 180 top
J2  18.41,20.95 180 top
J3  30.48,20.95 180 top
J4  42.55,20.95 180 top
J5  6.35,6.35 180 top
J6  18.41,6.35 180 top
J7  30.48,6.35 180 top
J8  42.55,6.35 180 top
JP1  44.45,55.56 0 bottom
JP2  45.09,76.52 270 bottom
JP3  24.45,101.6 270 bottom
L1  14.61,101.28 180 top
L2  20,95.25 180 top
L3  14.61,94.93 0 top
LED1  24.45,93.66 0 top
LED2  7.3,59.69 0 top
Q1  26.35,70.8 0 top
Q2  44.77,36.19 270 top
R1  14.61,104.14 180 top
R2  40.64,92.08 180 top
R3  22.54,91.44 90 top
R4  24.45,91.44 90 top
R5  26.35,91.44 90 top
R6  7.3,87 270 top
R7  24.45,84.14 180 top
R8  6.03,81.92 180 top
R9  12.38,81.92 0 top
R10  8.26,80.96 270 top
R11  10.16,80.96 270 top
R12  6.03,80.33 0 top
R13  12.38,80.33 180 top
R14  40.64,77.47 0 top
R15  6.03,66.36 0 top
R16  12.38,66.36 180 top
R17  6.03,64.77 180 top
R18  12.38,64.77 0 top
R19  8.26,64.45 90 top
R20  10.16,64.45 90 top
R21  14.92,58.74 180 top
R22  14.92,57.15 180 top
R23  37.78,52.07 180 top
R24  33.02,44.77 90 top
R25  27.3,44.13 270 top
R26  7.3,42.23 180 top
R27  20.32,42.23 180 top
R28  7.94,31.43 90 top
R29  9.53,31.43 90 top
R30  11.11,31.43 270 top
R31  23.81,30.16 270 top
R32  4.45,27.3 270 top
R33  22.23,26.99 270 top
R34  23.81,26.99 270 top
R35  9.21,26.67 0 top
R36  21.91,12.7 90 top
R37  23.5,12.7 270 top
R38  25.08,12.7 270 top
R39  26.99,12.7 90 top
R40  9.53,12.06 0 top
R41  15.56,12.06 180 top
R42  33.66,12.06 0 top
R43  39.37,12.06 180 top
SW1  42.23,87.95 180 top
SW2  42.23,81.6 0 top
SW3  7.3,53.34 90 top
TP1  33.66,64.45 0 top
TP2  35.56,59.05 0 top
TP3  39.37,59.05 0 top
TP4  32.38,56.2 0 top
U$2  [ROHS_BIG]  31.11,63.5 0 bottom

### Tracks (layer width: path | path; a pad name or v marks a point on that pad's centre or on a via)
+3V3  (via drill 0.6)
  Top 0.254: C20.1 18.22,53.25 IC4.32 | C21.1 28.26,50.8 27.88,51.18 IC4.48 | JP1.1 45.72,60.01 45.09,60.64 43.5,60.64 42.23,61.91 42.23,70.8 40.96,72.07 40.96,74.3 45.09,78.42 47.31,78.42 47.62,78.74 47.62,83.19 47.21,83.6 SW2.B' SW2.B 38.73,83.5 36.2,83.5 | R2.2 36.83,92.08 32.86,88.11 | C18.1 16.51,61.28 16.93,60.85 IC4.19 | 32.86,88.11 | v29.21,44.45 28.89,44.13 C27.1 | R25.2 27.51,43.08 C27.1 | C27.1 C28.1 30.27,43.18 30.8,43.18 31.64,42.33 IC5.1 | v31.59,45.56 31.65,45.62 R24.2 | D3.2 13.97,51.12 14.61,51.75 v18.1,51.75
  Top 0.305: v30.16,65.72 30.16,63.28 C17.1 30.07,62.98 IC4.64 | v36.51,47.94 36.83,48.26 41.27,48.26 41.59,47.94 C23.+ 44.13,47.94 44.13,46.99 43.76,46.62 C24.1 43.76,44.39 43.18,43.81 43.18,42.39 42.48,41.68 IC5.27
  Top 0.406: v29.21,52.39 28.93,52.11 C21.1 | 18.22,53.25 18.1,53.12 v18.1,51.75 | L2.1 28.89,95.25 29.53,94.61 29.53,94.3 | v38.42,65.72 38.42,75.25 36.2,77.47 36.2,83.5 36.2,84.77 32.86,88.11 29.53,91.44 29.53,94.3 | v15.88,62.55 15.9,62.52 C18.1 | v20.64,60.01 v27.94,60.01 | IC1.3 42.82,97.16 33.66,97.16 32.84,96.34 C4.+ 32.74,94.19 C5.1 30.38,94.3 29.53,94.3
  Bottom 0.254: 29.21,45.56 v31.59,45.56
  Bottom 0.305: v36.51,47.94 34.61,49.85 31.75,49.85 v29.21,52.39
  Bottom 0.406: v38.42,65.72 v30.16,65.72 27.94,63.5 v27.94,60.01 27.94,53.66 v29.21,52.39 29.21,45.56 v29.21,44.45 | v18.1,51.75 19.68,53.34 19.68,56.52 20.64,57.47 v20.64,60.01 20.64,60.64 18.73,62.55 v15.88,62.55
+3V3_A  (via drill 0.6)
  Top 0.254: C13.1 8.57,68.16 8.57,68.58 9.21,69.22 IC3.4 | 18.95,66.78 C15.1 19.79,66.67 20.64,66.67 21.27,66.04 C16.1 21.91,65.94 21.91,65.41 21.88,65.38 IC4.13
  Top 0.305: 26.99,77.18 R7.P$1 26.95,75.84 26.67,75.56 18.41,75.56 17.46,74.61 17.46,68.26 18.95,66.78 | 34.29,37.78 IC5.8 31.43,37.78 31.11,37.47 30.74,37.47 C30.1 30.54,37.47 29.53,37.47 28.92,36.86 C29.+ 28.92,37.44 28.57,37.78 24.13,37.78 22.82,36.47 R27.P$1 | v37.15,37.47 36.83,37.78 34.29,37.78 | 34.29,37.78 34.29,34.29 33.88,33.88 IC5.14
  Top 0.406: 26.99,77.18 26.99,78.74 24.45,81.28 19.05,81.28 16.51,83.82 16.51,93.03 | R26.P$1 13.05,35.53 14.61,33.97 22.23,33.97 22.82,34.57 R27.P$1 | v13.65,93.03 16.51,93.03 | C13.1 8.26,67.84 v8.26,66.67 | L2.2 18.73,95.25 16.51,93.03
  Bottom 0.305: v37.15,37.47 38.1,37.47 39.85,39.21 39.85,43.34 40.28,43.77 R23.P$1
  Bottom 0.406: v13.65,93.03 3.17,82.55 3.17,66.67 | 3.17,66.67 3.17,46.99 6.35,43.81 6.35,40.64 9.8,37.19 R26.P$1 | 3.17,66.67 v8.26,66.67
ALGORITHM_CV
  Top 0.254: R15.1 C12.2 5.18,68.68 5.4,68.9 IC3.1 5.4,72.39 6.35,73.34 14.29,73.34 14.92,72.71 14.92,68.9 14.92,67.63 14.92,66.99 18.1,63.82 18.73,63.82 19.68,62.87 19.68,60.96 19.08,60.35 IC4.20 18.25,60.33
ALGORITHM_POT
  Top 0.254: IC4.14 21.38,64.98 20.64,65.72 19.05,65.72 16.83,67.94 16.83,77.47 18,78.64 C9.1 24.23,78.64 24.45,78.42 R7.P$2
AREF_-10  (via drill 0.6)
  Top 0.254: R10.2 R11.2 v10.16,78.74 | v10.16,66.67 R20.2 R19.2 | R6.2 8.26,86.14 C6.1 10.55,86.14 IC2.2 10.65,85.26 v10.16,84.77
  Bottom 0.254: v10.16,66.67 v10.16,78.74 v10.16,84.77
AUX_OUT
  Top 0.254: IC5.13 31.68,34.53 31.43,34.29 31.43,33.02 29.84,31.43 29.69,31.27 28.92,30.51 C39.+
BOOT_FLASH  (via drill 0.6)
  Top 0.254: 41.59,79.6 SW2.A 38.73,79.5 38.73,76.83 39.69,75.88 39.69,62.55 v37.47,60.33 | 41.59,79.6 SW2.A' | v33.02,60.33 32.55,59.85 IC4.60 | R14.2 41.59,77.57 41.59,79.6
  Bottom 0.254: v33.02,60.33 v37.47,60.33
GND  (via drill 0.6)
  other vias: 42.23,42.86 26.99,40.96 8.26,78.74 7.94,72.39 30.8,49.21 14.29,63.18 36.83,39.37 23.18,67.94 19.68,72.71 33.02,72.71 22.54,62.23 41.59,81.6 32.07,64.77 7.62,105.41 47.31,100.01 1.59,99.06 1.59,88.9 1.59,7.62 12.7,1.59 24.13,1.59 36.83,1.59 47.31,7.62 47.31,17.78 45.09,27.62 45.4,36.2 47.31,50.01 37.47,99.06 32.07,92.71 10.79,99.38 5.4,92.08 14.61,53.02 25.08,54.61 21.91,57.47 33.02,67.31 30.8,52.39 12.38,72.39 29.84,89.53 37.47,63.5 37.15,74.3 26.04,30.96 15.24,27.3 20.64,27.3 33.66,85.72 38.1,42.39 28.89,34.77 46.67,30.96 8.57,29.21 35.88,92.71 40.64,101.6 42.55,101.6 44.45,101.6 46.35,101.6 47.31,98.11 47.31,96.2 47.31,94.3 35.24,36.51 42.23,35.88 46.67,41.27 46.99,46.2 38.73,32.7
  pour Bottom: 0,106.68 0,0 48.9,0 48.9,106.68
  pour Top: 0,106.68 48.9,106.68 48.9,0 0,0
I2C_SCL  (via drill 0.6)
  Top 0.254: IC5.24 40.22,39.69 38.89,39.69 35.24,43.34 34.29,43.34 33.71,43.92 R24.1 31.81,43.92 29.53,46.2 24.45,46.2 | v22.23,55.88 21.27,55.88 21.25,55.85 IC4.29 | 24.45,46.2 23.18,47.47 23.18,48.9 v22.86,49.21 | 24.45,46.2
  Bottom 0.254: v22.23,55.88 22.54,55.56 22.54,54.29 22.23,53.98 22.23,49.85 v22.86,49.21
I2C_SDA  (via drill 0.6)
  Top 0.254: IC5.23 40.23,39.05 38.73,39.05 34.92,42.86 32.07,42.86 29.21,45.72 27.3,45.72 | v21.59,54.61 20.85,55.35 IC4.30 | v22.23,47.94 22.23,47.31 23.81,45.72 27.3,45.72 | R25.1 | 27.3,45.72 R25.1
  Bottom 0.254: 21.59,49.53 21.59,48.9 | v22.23,47.94 21.91,48.26 21.91,49.21 21.59,49.53 | 21.59,49.53 v21.59,54.61
I2S_LRCK
  Top 0.254: IC5.5 33.93,39.73 34.29,39.37 34.29,38.73 33.97,38.42 32.77,38.42 IC5.7 32.74,38.42 22.7,38.42 19.05,42.07 19.05,49.85 20.38,51.18 IC4.33
I2S_SCK  (via drill 0.6)
  Top 0.254: v20,49.53 20,49.85 20.88,50.73 IC4.34 | IC5.3 31.67,41.03 30.48,39.85 23.65,39.85 20.95,42.55 20.95,46.04 v21.27,46.35
  Bottom 0.254: v20,49.53 20,47.62 v21.27,46.35
I2S_SIN
  Top 0.254: 32.73,39.05 IC5.6 31.46,39.08 31.27,38.89 23.02,38.89 20.32,41.59 | IC4.35 21.38,49.95 20.95,49.53 20.95,48.9 19.68,47.62 19.68,42.23 20.32,41.59 | 20.32,41.59
I2S_SOUT
  Top 0.254: 32.7,40.32 IC5.4 31.81,40.38 30.8,39.37 23.34,39.37 20.32,42.39 20.32,47.31 21.59,48.58 21.59,49.37 21.88,49.66 IC4.36
IN_1
  Top 0.254: IC5.20 38.72,37.13 38.1,36.51 38.1,36.04 34.61,32.54 34.61,31.3 C37.+
IN_2
  Top 0.254: IC5.19 39.02,36.48 38.73,36.2 38.73,35.56 36.2,33.02 36.2,27.65 C43.+
JTCK  (via drill 0.6)
  Top 0.254: IC4.49 30.8,54.35 | 30.8,54.35 31.18,54.35 | JP1.4 42.86,58.1 42.55,58.1 v40.96,58.1 | v40.96,55.24 40.32,55.88 34.92,55.88 33.4,54.35 30.8,54.35
  Bottom 0.254: v40.96,55.24 40.96,55.88 41.27,56.2 41.27,57.78 v40.96,58.1
JTDI
  Top 0.254: IC4.50 30.88,54.85 32.95,54.85 34.61,56.52 41.59,56.52 42.55,56.52 42.86,56.52 43.81,55.56 JP1.8
JTDO
  Top 0.254: JP1.6 43.5,56.83 43.18,57.15 42.55,57.15 42.23,57.15 41.91,57.15 38.1,57.15 36.83,57.15 36.63,57.35 IC4.55
JTMS  (via drill 0.6)
  Top 0.254: JP1.2 42.55,59.37 v42.23,59.05 | v42.23,55.56 42.23,54.93 41.59,54.29 40.64,54.29 39.69,55.24 35.24,55.24 33.81,53.82 27.78,53.82 26.88,52.91 IC4.46
  Bottom 0.254: v42.23,55.56 42.23,56.2 41.91,56.52 41.91,58.1 41.91,58.74 v42.23,59.05
LED_B
  Top 0.254: R4.1 24.45,89.85 25.4,88.9 28.26,88.9 33.97,83.19 33.97,76.52 35.56,74.93 35.56,61.59 33.32,59.35 IC4.59
LED_CARRIER_G
  Top 0.254: R22.1 16.51,57.15 17.21,57.85 IC4.25
LED_CARRIER_R
  Top 0.254: R21.1 16.83,58.74 17.21,58.35 IC4.24
LED_G
  Top 0.254: R5.1 26.35,89.85 26.67,89.53 28.57,89.53 34.61,83.5 34.61,76.83 36.2,75.25 36.2,61.28 33.77,58.85 IC4.58
LED_R
  Top 0.254: R3.1 22.54,89.85 24.13,88.27 27.94,88.27 33.34,82.87 33.34,76.2 34.92,74.61 34.92,62.55 33.66,61.28 32.7,61.28 31.78,60.35 IC4.61
LEVEL_1_CV
  Top 0.254: R13.1 C8.2 13.23,78 13.02,77.79 IC3.8 13.02,74.93 13.34,74.61 14.92,74.61 16.19,73.34 16.19,69.53 16.19,68.26 16.19,67.63 18.73,65.09 20.32,65.09 20.64,65.09 20.88,64.84 IC4.15
LEVEL_1_POT
  Top 0.254: IC4.21 17.3,59.85 16.83,60.33 13.65,60.33 12.06,61.91 4.76,61.91 3.81,60.96 3.81,58.74 4.45,58.1 5.4,58.1 6.35,57.15 6.35,46.04 7.94,44.45 7.94,39.37 7.3,38.73 R26.P$2 7.3,34.61 6.03,33.34 5.5,33.34 C33.1
LEVEL_2_CV
  Top 0.254: R12.1 C7.2 5.18,78 5.4,77.79 IC3.14 5.4,74.93 6.35,73.98 13.34,73.98 14.61,73.98 15.56,73.03 15.56,69.53 15.56,69.22 15.56,67.94 15.56,67.31 18.41,64.45 19.68,64.45 20.1,64.04 IC4.16
LEVEL_2_POT
  Top 0.254: R27.P$2 20.32,36.51 19.05,37.78 15.56,37.78 | 15.56,37.78 10.16,37.78 8.57,39.37 8.57,44.77 6.99,46.35 6.99,57.47 5.71,58.74 4.6,58.74 4.29,59.05 4.29,60.48 5.08,61.28 11.75,61.28 13.34,59.69 16.51,59.69 16.85,59.35 IC4.22 | 15.56,37.78 C31.1
MOD_OUT
  Top 0.254: 32.7,35.24 IC5.12 31.69,35.18 30.96,34.45 30.96,33.66 30,32.7 C32.+
N$1
  Top 0.254: R9.2 13.34,82.02 13.34,82.55 13.02,82.87 4.45,82.87 3.49,81.92 3.49,77.15 3.49,65.72 1.27,63.5 | 1.27,63.18 1.27,46.67 5.08,42.86 5.08,41.27 1.27,37.47 1.27,20.32 5.08,16.51 J1.P3 | 1.27,63.18 1.27,63.5 | 1.27,63.18 1.27,63.5 | 1.27,63.18 1.27,63.5
N$2
  Top 0.254: R11.1 10.26,81.92 R9.1 R13.2 C8.1 11.53,78 11.75,77.79 IC3.9
N$3
  Top 0.254: LED2.3 10.48,59.69 11.75,59.69 12.7,58.74 R21.2
N$4
  Top 0.254: J2.P3 17.14,17.78 4.76,17.78 1.91,20.64 1.91,37.15 5.71,40.96 5.71,43.18 1.91,46.99 1.91,63.18 4.13,65.41 4.13,73.98 4.13,81.6 4.45,81.92 R8.2
N$5
  Top 0.254: R10.1 8.15,81.92 R8.1 R12.2 C7.1 6.88,78 6.67,77.79 IC3.13
N$6  (via drill 0.6)
  Top 0.254: v32.38,16.51 31.11,17.78 29.21,17.78 27.94,19.05 8.26,19.05 5.4,19.05 3.17,21.27 3.17,36.51 6.99,40.32 6.99,43.81 3.17,47.62 3.17,59.69 3.17,61.28 4.45,62.55 11.75,62.55 12.7,62.55 13.23,63.08 R18.2
  Bottom 0.254: v32.38,16.51 J4.P3
N$7
  Top 0.254: Q1.2 31.22,70.84 C11.2 | Q1.2 31.11,70.74 31.11,70.48 | IC4.5 25.88,67.16 27.62,68.9 30.48,68.9 30.8,69.22 31.18,69.6 Q1.2
N$8
  Top 0.254: IC4.6 25.38,67.33 23.81,68.9 22.23,68.9 21.53,69.6 Q1.1 21.49,70.84 C10.2
N$9
  Top 0.254: J1.P2 5.4,24.13 4.45,25.08 R32.2
N$10
  Top 0.254: R17.2 4.45,64.77 2.54,62.87 2.54,47.31 6.35,43.5 6.35,40.64 2.54,36.83 2.54,20.95 5.08,18.41 27.62,18.41 28.26,17.78 29.53,16.51 J3.P3
N$11
  Top 0.254: IC3.2 6.67,68.9 6.88,68.68 C12.1 R15.2 R17.1 6.88,63.92 7.3,63.5 8.15,63.5 R19.1
N$12
  Top 0.254: R35.2 10.16,26.57 10.16,25.08 11.11,24.13 J2.P2
N$13
  Top 0.254: C22.1 27.3,50.16 27.38,50.24 IC4.47
N$14
  Top 0.254: LED2.1 5.71,59.69 6.67,58.74 10.48,58.74 11.75,58.74 13.34,57.15 R22.2
N$15
  Top 0.254: R20.1 10.26,63.5 11.11,63.5 11.53,63.92 R18.1 R16.2 C14.1 11.53,68.68 11.75,68.9 IC3.6
N$16
  Top 0.406: IC1.2 40.86,104.78 34.61,104.78 33.66,103.82 33.66,101.6 C2.+ 32.84,103.68 31.75,104.78 18.1,104.78 17.46,104.14 R1.1
N$17
  Top 0.254: IC5.16 41.35,34.53 41.91,33.97 41.91,31.43 41.59,31.11 C36.+ 40.51,28.55 C42.1
N$18
  Top 0.254: C37.- 32.2,26.22 35.56,22.86 35.56,17.46 33.34,15.24 24.45,15.24 23.5,14.29 R37.1 R36.2 C44.1
N$19
  Top 0.254: C19.1 16.75,54.85 IC4.31
N$20
  Top 0.254: R38.2 25.08,6.35 20.64,1.91 J6.P3
N$21
  Top 0.254: R37.2 23.5,7.3 19.68,3.49 13.34,3.49 11.75,1.91 J5.P3
N$22
  Top 0.254: C43.- 33.62,25.75 36.2,23.18 36.2,17.14 33.66,14.61 25.72,14.61 25.08,13.97 R38.1 R39.2 C45.1
N$23
  Top 0.254: R33.2 R34.2 23.91,26.04 25.08,26.04 26.32,27.27 C39.-
N$24
  Top 0.254: TP3.P$1 39.37,58.42 38.8,57.85 IC4.56
N$25
  Top 0.254: R34.1 R31.2 C38.1 21.8,29.31 21.27,29.84 IC6.6
N$26
  Top 0.254: TP2.P$1 34.86,58.35 IC4.57
N$27
  Top 0.254: TP4.P$1 31.43,56.2 31.09,55.85 IC4.52
N$28  (via drill 0.6)
  Top 0.254: 38.42,12.17 R43.2 38.52,16.61 39.05,17.14 v39.05,18.41 | v34.29,18.41 32.38,18.41 31.75,19.05 29.84,19.05 24.77,24.13 21.27,24.13 19.68,25.72 19.68,27.3 19.05,27.94 18.73,27.94 18.41,28.26 18.41,30.8 18.73,31.11 IC6.7 20.16,31.01 C38.2 R31.1
  Bottom 0.254: v34.29,18.41 v39.05,18.41
N$29
  Top 0.254: J8.P3 42.55,2.86 40.22,5.18 R43.1
N$30
  Top 0.254: TP1.P$1 33.66,63.82 33.66,63.18 33.66,62.23 33.34,61.91 32.38,61.91 31.32,60.85 IC4.62
N$31
  Top 0.254: C32.- 26.99,32.7 26.04,33.66 22.86,33.66 22.54,33.34 9.84,33.34 9.53,33.02 R29.2 R28.2
N$32
  Top 0.254: R29.1 R30.2 C35.1 12.91,30.8 13.34,30.8 13.65,31.11 IC6.2
N$33  (via drill 0.6)
  Top 0.254: v33.34,17.46 32.38,17.46 31.43,18.41 29.53,18.41 24.45,23.5 20.95,23.5 19.05,25.4 17.78,25.4 17.14,26.04 17.14,27.3 17.78,27.94 17.78,30.8 16.19,32.38 IC6.1 12.8,32.38 C35.2 R30.1 | R42.2 34.61,12.17 34.61,14.29 v37.78,17.46
  Bottom 0.254: v33.34,17.46 v37.78,17.46
N$34
  Top 0.254: J7.P3 30.48,2.86 32.8,5.18 R42.1
N$35
  Top 0.254: R3.2 LED1.RED
N$36
  Top 0.254: R4.2 24.45,92.71 25.08,93.34 LED1.BLU
N$37
  Top 0.254: R5.2 LED1.GRN
N$38
  Top 0.254: J6.P2 17.14,9.53 16.41,10.26 R41.1
N$39
  Top 0.254: J5.P2 7.62,9.53 8.68,10.58 R40.1
N$40
  Top 0.254: C41.2 46.77,29.37 44.77,29.37 Q2.2 44.77,35.08 42.7,37.15 42.7,39.85 42.17,40.38 IC5.25
N$41
  Top 0.254: C26.2 46.73,42.7 44.77,42.7 Q2.1 44.77,37.47 44.45,37.15 43.81,37.15 43.18,37.78 43.18,40.48 42.63,41.03 IC5.26
N$42
  Top 0.406: D1.C 12.7,100.65 13.34,101.28 L1.2
N$43
  Top 0.406: D2.A 13.65,96.84 15.3,95.19 L3.2
N$56
  Top 0.406: JP3.2 JP3.1 | JP3.2 | D1.A 17.78,99.38 18.73,100.33 JP3.2
N$64
  Top 0.406: JP3.9 29.53,100.97 JP3.10 29.53,99.06 28.89,98.42 19.37,98.42 17.78,96.84 D2.C
NORMALIZATION_PROBE  (via drill 0.6)
  Top 0.254: 4.55,28.26 4.45,28.36 | 18.41,47.94 18.41,41.59 15.88,39.05 12.7,39.05 v12.38,39.37 | 18.41,47.94 18.41,50.01 19.84,51.44 19.84,53.18 20,53.34 23.18,53.34 23.38,53.14 IC4.39 | v12.38,34.29 12.06,33.97 9.53,33.97 8.89,33.34 6.99,33.34 6.35,32.7 6.35,28.26 | 6.35,28.26 4.55,28.26 | 6.35,28.26 7.62,28.26 8.36,27.52 R35.1 8.57,26.45 8.57,22.54 v10.79,20.32 | 14.61,12.17 R41.2 R40.2 10.38,16.09 v10.79,16.51 | D3.3 15.09,47.94 18.41,47.94 | 4.55,28.26 R32.1
  Bottom 0.254: v12.38,34.29 v12.38,39.37 | v10.79,16.51 v10.79,20.32
PARAMETER_CV
  Top 0.254: IC3.7 13.02,68.9 13.23,68.68 C14.2 R16.1 13.97,66.36 14.29,66.04 14.92,65.41 17.46,62.87 18.22,62.11 | 18.22,62.11 IC4.17 18.22,62.11
PARAMETER_POT  (via drill 0.6)
  Top 0.254: 37.78,46.67 R23.P$2 | v23.81,50.8 23.81,50.48 24.45,49.85 24.45,47.78 25.56,46.67 37.78,46.67 | v23.5,57.78 22.86,58.42 20,58.42 19.57,58.85 IC4.23 | C25.1 42.23,46.67 41.91,46.99 39.69,46.99 39.37,46.67 37.78,46.67
  Bottom 0.254: v23.81,50.8 23.81,57.47 v23.5,57.78
RESET  (via drill 0.6)
  Top 0.254: 38.73,86.04 SW1.B' 38.92,86.04 v43.18,86.04 | 44.45,53.34 44.45,51.75 43.02,50.32 34.45,50.32 32.23,48.1 26.51,48.1 26.04,48.58 26.04,50.48 v26.35,50.8 | 44.45,53.34 JP1.10 | 44.45,53.34 46.04,53.34 46.67,53.98 46.67,60.33 45.72,61.28 43.81,61.28 42.86,62.23 42.86,73.03 v42.23,73.66 | SW1.B 45.53,86.04 v43.18,86.04 | v26.35,61.59 24.88,63.07 IC4.7 | v43.18,86.04 43.18,91.44 42.55,92.08 R2.1
  Bottom 0.254: v26.35,50.8 v26.35,61.59 | v43.18,86.04 43.18,74.61 v42.23,73.66
RX
  Top 0.254: 25.4,52.24 IC4.43 25.38,48.44 26.19,47.62 32.54,47.62 34.61,49.69 43.18,49.69 47.31,53.82 | JP2.4 44.13,68.9 43.5,68.26 43.5,62.55 44.13,61.91 46.04,61.91 47.31,60.64 47.31,53.82 | 47.31,53.82
SW_CARRIER
  Top 0.254: IC4.27 17.48,56.85 17.3,56.67 17.3,56.36 16.83,55.88 11.11,55.88 10.4,56.59 SW3.4 SW3.3
TX
  Top 0.254: IC4.42 24.88,48.15 25.88,47.15 32.86,47.15 34.77,49.05 43.34,49.05 47.94,53.66 47.94,60.96 46.67,62.23 46.67,65.72 46.04,66.36 JP2.5
VCC  (via drill 0.6)
  Top 0.406: C34.1 IC6.8 v17.78,32.38 | v3.17,86.68 3.17,97.47 5.54,99.83 C1.+ 5.71,101.6 5.71,102.87 6.99,104.14 R1.2 13.18,103.02 13.65,102.55 14.92,102.55 15.56,101.92 15.56,101.33 L1.1
  Bottom 0.406: v3.17,86.68 2.54,86.04 2.54,46.67 5.71,43.5 5.71,40.64 3.17,38.1 3.17,34.61 5.4,32.38 v17.78,32.38
VEE  (via drill 0.6)
  Top 0.406: v1.59,85.09 3.49,85.09 5.08,86.68 5.08,87.63 | IC6.4 C40.2 12.6,27.73 v13.02,27.3 | L3.1 12.7,94.93 12.06,94.3 C3.- 9.53,94.3 9.53,93.34 5.08,88.9 5.08,87.63 | R6.1 7.09,87.63 5.08,87.63
  Bottom 0.406: v1.59,85.09 1.91,84.77 1.91,46.35 5.08,43.18 5.08,40.96 2.54,38.42 2.54,33.81 9.05,27.3 v13.02,27.3

### Text on the board
tNames: RESET | SYSBOOT | Warps | cc-by-sa | Émilie Gillet | 2015. v3
bNames: stripe | Red | +12V | GND | -12V | GND | <TX | JTAG | Warps | cc-by-sa Émilie Gillet, 2015. v3